# Altium schematic sheet BootMemory.SchDoc
size A4
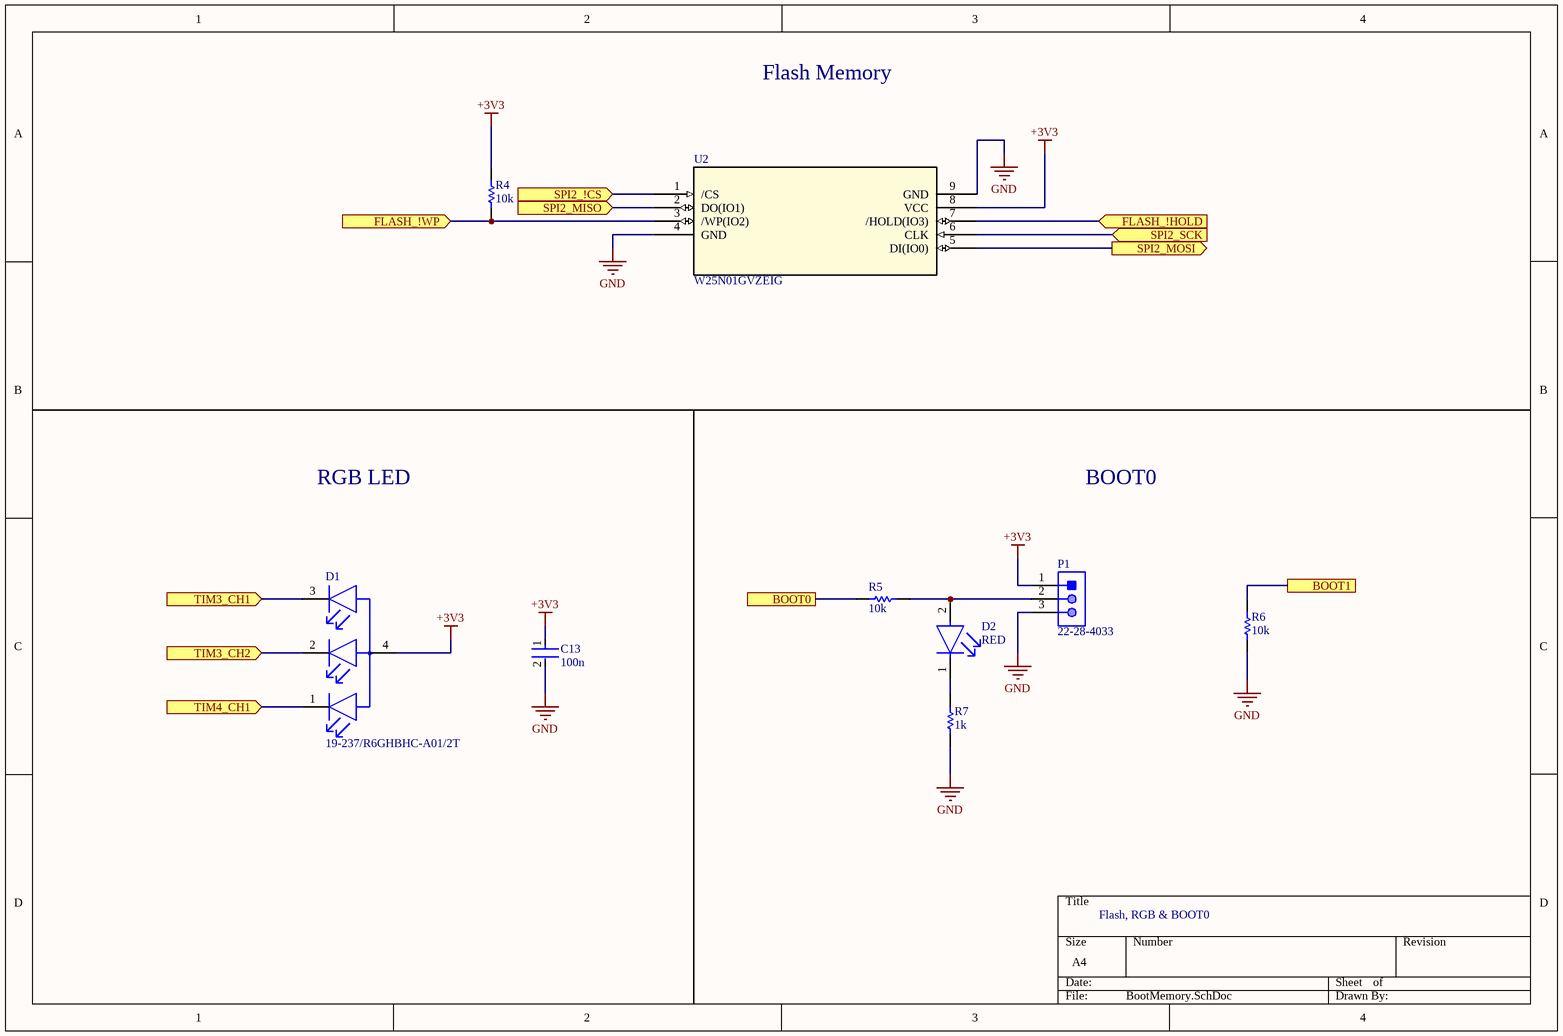
[diagram p0: BootMemory.SchDoc]

## Parts
C13  100n  [Capacitor 0402]
D1  19-237/R6GHBHC-A01/2T  [19337R6GHBHCA012T]
D2  RED  [FP-LTST-C190GKT-MFG]
P1  22-28-4033  [HDRV10W90P254_1X3_1270X483X840P]
R4  10k  [Resistor 0402]
R5  10k  [Resistor 0402]
R6  10k  [Resistor 0402]
R7  1k  [Resistor 0402]
U2  W25N01GVZEIG  [SON127P800X600X80-9N-D]

## Ports
BOOT0, BOOT1, FLASH_!HOLD (in), FLASH_!WP (in), SPI2_!CS (in), SPI2_MISO (in), SPI2_MOSI (out), SPI2_SCK (in), TIM3_CH1 (in), TIM3_CH2 (in), TIM4_CH1 (in)

## Nets
+3V3: C13.1 D1.4(COMMON_ANODE) P1.1 R4.2 U2.8(VCC)
GND: C13.2 P1.3 R6.2 R7.2 U2.4(GND) U2.9(GND)
BOOT0: R5.2 ; port BOOT0
BOOT1: R6.1 ; port BOOT1
FLASH_!HOLD: U2.7(/HOLD(IO3)) ; port FLASH_!HOLD
FLASH_!WP: R4.1 U2.3(/WP(IO2)) ; port FLASH_!WP
SPI2_!CS: U2.1(/CS) ; port SPI2_!CS
SPI2_MISO: U2.2(DO(IO1)) ; port SPI2_MISO
SPI2_MOSI: U2.5(DI(IO0)) ; port SPI2_MOSI
SPI2_SCK: U2.6(CLK) ; port SPI2_SCK
TIM3_CH1: D1.3(BLUE_C) ; port TIM3_CH1
TIM3_CH2: D1.2(GREEN_C) ; port TIM3_CH2
TIM4_CH1: D1.1(RED_C) ; port TIM4_CH1
NetD2_1: D2.1(C) R7.1
NetD2_2: D2.2(A) P1.2 R5.1

## Notes on the sheet
- Flash Memory
- RGB LED
- BOOT0
- Flash, RGB & BOOT0

## Library data of the parts
C13 = Capacitor 0402: Chip Capacitor 0402; Manufacturer Part Number: CC0402KRX7R7BB103; Manufacturer: Yageo; Automotive Grade: NA; Capacitance: 10 nF; Material: Ceramic; Value: 10 nF; Tolerance: 0.1; Temperature Characteristic: X7R; Voltage Rating: 16 V; Temperature Coefficient: 30ppm/°C; Temperature Range Low: -55°C; Temperature Range High: +125°C; Mouser Description: 0402 10 nF 16 V ±10 % Tolerance X7R SMT Multilayer Ceramic Capacitor; Footprint Url: http://www.yageo.com/exep/pages/download/literatures/UPY-C_GEN_24.pdf; Category: Cap; RoHS: TRUE; ComponentLink2Description: Datasheet; Ipc Land Pattern Name: CAPC10050X50; Automotive: No; ComponentLink2URL: http://www.yageo.com/documents/recent/UPY-GP_NP0_16V-to-50V_16.pdf; Device Class L1: Passive Components; Height: 0.55mm; Package: CC0402; Device Class L3: Ceramic Capacitors; Lead Free: Yes; Device Class L2: Capacitors; Digikey Description: CAP CER 10000PF 16V X7R 0402; Octopart: https://octopart.com/cc0402krx7r7bb103-yageo-192895; Temperature: -55°C to +125°C
D1 = LED RGB: LED RGB CLEAR CHIP SMD R/A; Manufacturer: Everlight; Manufacturer Part Number: 12-23A/R6GHBHC-A01/2D; Colour: Red, Green, Blue; Forward Current: 20mA; Forward Voltage: 2/3.3/3.3V; Viewing Angle: 120°; Led Orientation: Side View; Luminous Intensity: 90/180/72mcd; Wavelength: 624/525/470nm; Reverse Voltage: 5V; Peak Emmision Wavelength: 632/518/468nm; Power Dissipation: 60/110/110mW; Digikey Description: LED RGB CLEAR CHIP SMD R/A; Octopart: https://octopart.com/12-23a%2Fr6ghbhc-a01%2F2d-everlight-10561613; ComponentLink2Description: Datasheet; Lead Free: Yes; Device Class L2: LEDs; Automotive: No; Mouser Description: Standard LEDs - SMD RGB WATER CLEAR RIGHT ANGLE LENS; Category: Diode; Device Class L3: unset; Temperature Range Low: -40°C; Package: 12-23A; Device Class L1: Optoelectronics; Temperature Range High: +85°C; Height: 2.1mm; RoHS: TRUE; Temperature: -40°C to +85°C; ComponentLink2URL: https://media.digikey.com/pdf/Data%20Sheets/Everlight%20PDFs/12-23A,R6GHBHC-A01,2D.pdf
D2 = CMP-22017-000005-1: LED GREEN CLEAR CHIP SMD; Reverse Voltage: 5V; Power Dissipation: 100mW; Forward Voltage: 2.1V; Test Current: 10mA; Number of LEDs: 1; Viewing Angle: 130°; Forward Current: 30mA; Voltage: 2V; Wavelength: 565nm; Dominant Wavelength: 569nm; Luminous Intensity: 6mcd; Lens Color: Colorless; Packaging: Tape and Reel; Lens Transparency: Clear; Min Operating Temperature: -55°C; Case Code (Metric): 1608; Lens Style: Clear; Case/Package: 0603; Mount: Surface Mount; Package Quantity: 1; Height: 0.8mm; Illumination Color: Green; Radiation Hardening: No; Depth: 0.8mm; Number of Pins: 2; Max Operating Temperature: 85°C; Color: Green; Number of Elements: 1; Power Rating: 100mW; Case Code (Imperial): 0603; Width: 0.8mm; Length: 1.6mm; Lead Free: Lead Free
P1 = Male Header 01x03: Male Header, Pitch 2.54 mm, 1 x 3 Position, Height 8.38 mm, Tail Length 3.18 mm, RoHS, Bulk; Manufacturer: Molex; Rows: 1; Voltage Rating: 250 V; Current Rating: 4 A; Min Operating Temperature: 0 degC; Lead Pitch: 0.1 inch; Packaging: Bulk; Contact Finish: Gold; RoHSCompliant: true; Contact Material: Brass; PackageReference: 22-28-4033; REACH SVHC: Unknown; PackageDescription: Male Header, Pitch 2.54 mm, 1 x 3 Position, Height 8.38 mm, Tail Length 3.18 mm; ComponentLink2URL: http://www.molex.com/pdm_docs/sd/022284033_sd.pdf; Height: 8.38 mm; Mounting Technology: Through Hole; ComponentLink1Description: Manufacturer URL; Length: 7.62 mm; Mount: Through Hole; DatasheetVersion: Rev. G, 01/2012; Max Operating Temperature: 75 degC; ComponentLink2Description: Datasheet; Colour: Black; Pins: 3; Contact Plating: Gold; Package Quantity: 1; ComponentLink1URL: http://www.molex.com/; Manufacturer Part Number: 22-28-4033
R4-R7 = Resistor 0402: Chip Resistor 0402; Manufacturer: Vishay; Part Number: CRCW0402120RFKED; Manufacturer Part Number: CRCW0402120RFKED
U2 = W25N01GVZEIG: Flash memory; Vendor: Winbond; Built_By: EMA_Cory; SourceLibrary: Winbond_2020-02-06; Datasheet: https://www.winbond.com/resource-files/w25n01gv%20revl%20050918%20unsecured.pdf; Manufacturer_Part_Number: W25N01GVZEIG; Copyright: Copyright (C) 2018 Accelerated Designs. All rights reserved; RefDes: RefDes; Type: DEV